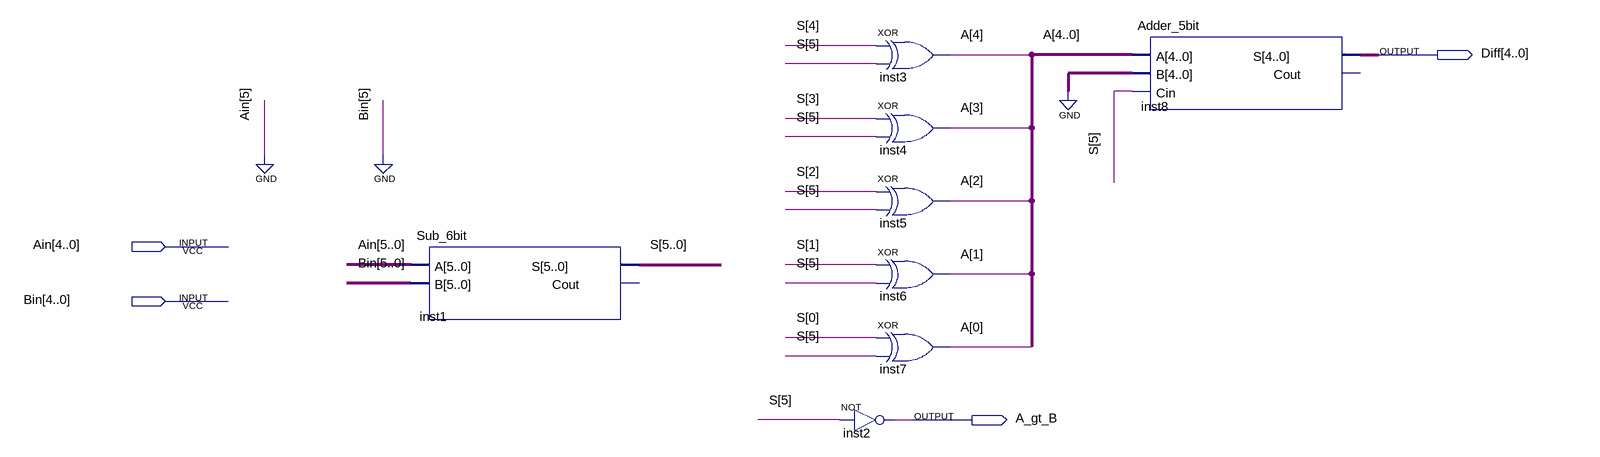
[diagram p0: schematic sheet]
// Quartus schematic Compare_5bit.bdf as structural Verilog: 8 symbols, 4 pins
module Compare_5bit (
  input  [4:0] Ain,
  input  [4:0] Bin,
  output [4:0] Diff,
  output A_gt_B
);

  wire [4:0] A;
  wire [5:0] S;

  Sub_6bit inst1 (.A({1'b0, Ain}), .B({1'b0, Bin}), .S(S));  // open: Cout
  not inst2 (A_gt_B, S[5]);
  xor inst3 (A[4], S[4], S[5]);
  xor inst4 (A[3], S[3], S[5]);
  xor inst5 (A[2], S[2], S[5]);
  xor inst6 (A[1], S[1], S[5]);
  xor inst7 (A[0], S[0], S[5]);
  Adder_5bit inst8 (.A(A), .B({5{1'b0}}), .Cin(S[5]), .S(Diff));  // open: Cout
endmodule
